# Altium project OCP-TimeCardMini-TI.PrjPcb (part 6 of 6)
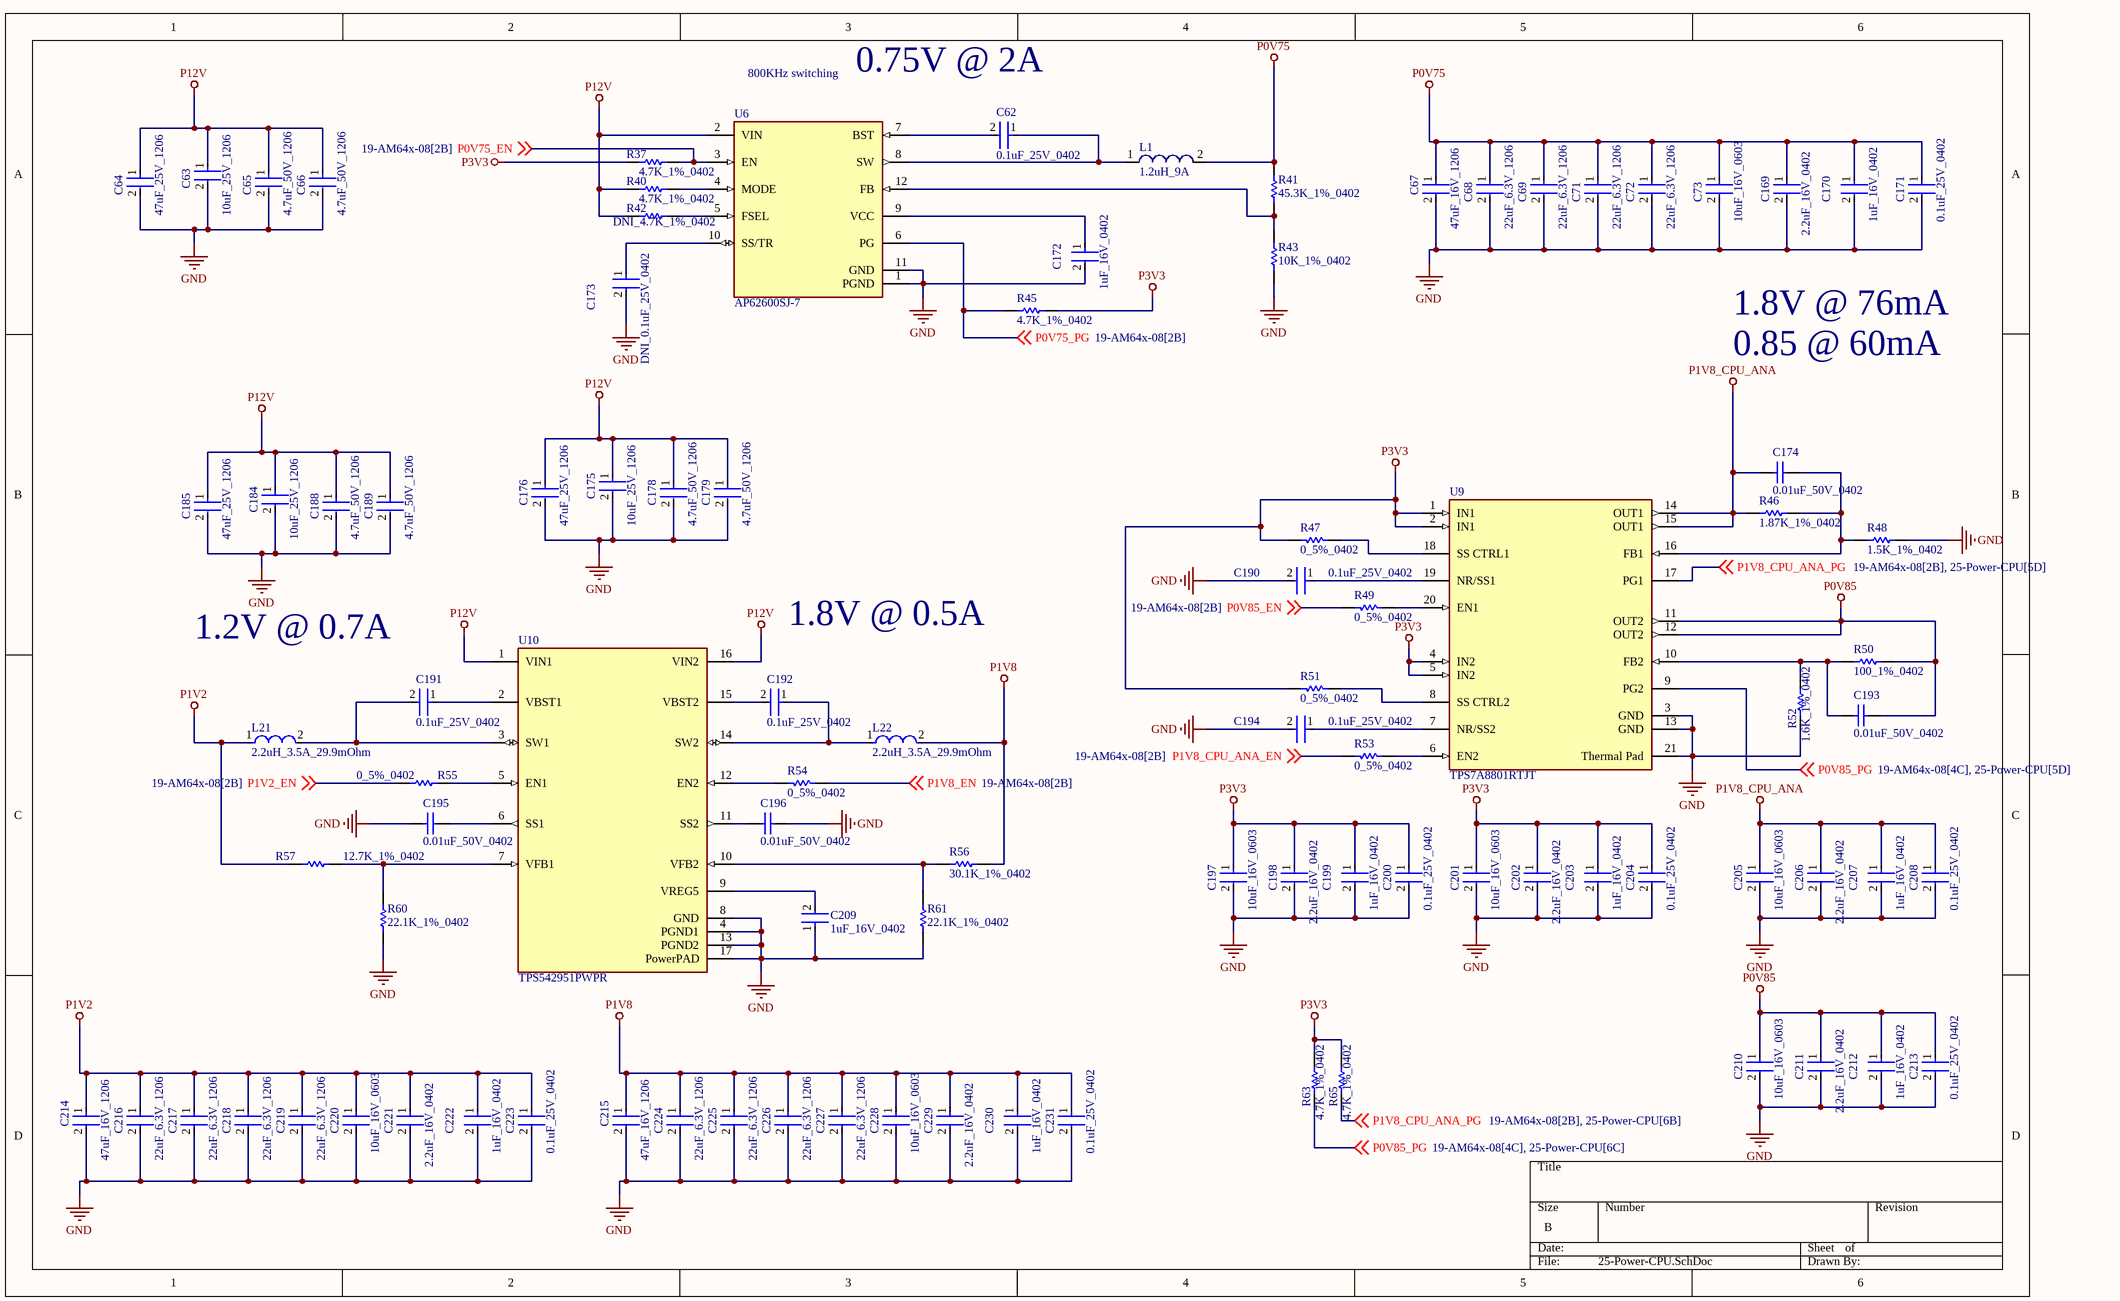
[diagram p25: 25-Power-CPU.SchDoc]

## Nets that join several sheets
DPLL_VDD_CLKA: 10-DPLL-1 (U7.71), 11-DPLL-2 (C134.1 C135.1 L15.2)
DPLL_VDD_CLKB: 10-DPLL-1 (U7.19), 11-DPLL-2 (C120.1 C121.1 L11.2)
DPLL_VDD_DCO_Q0123: 10-DPLL-1 (U7.62), 11-DPLL-2 (C102.1 C103.1 L6.2)
DPLL_VDD_DCO_Q4567: 10-DPLL-1 (U7.30), 11-DPLL-2 (C113.1 C114.1 L9.2)
DPLL_VDD_DIA_A: 10-DPLL-1 (U7.63), 11-DPLL-2 (C77.1 C78.1 L3.2)
DPLL_VDD_DIA_B: 10-DPLL-1 (U7.29), 11-DPLL-2 (C92.1 C93.1 L4.2)
DPLL_VDD_DIG: 10-DPLL-1 (U7.9), 11-DPLL-2 (5 pins)
DPLL_VDD_GPIO: 10-DPLL-1 (U7.46), 11-DPLL-2 (5 pins)
DPLL_VDDA_BG_LC: 10-DPLL-1 (U7.25 U7.26), 11-DPLL-2 (C83.1 C84.1 C85.1 L2.2)
DPLL_VDDA_FB: 10-DPLL-1 (U7.69), 11-DPLL-2 (C125.1 C126.1 L13.2)
DPLL_VDDA_PDCP_XTAL: 10-DPLL-1 (U7.68), 11-DPLL-2 (C99.1 C100.1 L5.2)
DPLL_VDDO_Q0: 10-DPLL-1 (U7.61), 11-DPLL-2 (C111.1 C112.1 L8.2)
DPLL_VDDO_Q1: 10-DPLL-1 (U7.55), 11-DPLL-2 (C127.1 C128.1 L12.2)
DPLL_VDDO_Q2: 10-DPLL-1 (U7.54), 11-DPLL-2 (C139.1 C140.1 L16.2)
DPLL_VDDO_Q3: 10-DPLL-1 (U7.50), 11-DPLL-2 (C148.1 C149.1 L18.2)
DPLL_VDDO_Q4: 10-DPLL-1 (U7.42), 11-DPLL-2 (C106.1 C107.1 L7.2)
DPLL_VDDO_Q5: 10-DPLL-1 (U7.38), 11-DPLL-2 (C118.1 C119.1 L10.2)
DPLL_VDDO_Q6: 10-DPLL-1 (U7.37), 11-DPLL-2 (C132.1 C133.1 L14.2)
DPLL_VDDO_Q7: 10-DPLL-1 (U7.31), 11-DPLL-2 (C143.1 C144.1 L17.2)
GND: 01-PCIe (21 pins), 02-USER_IO (15 pins), 04-Front Panel SFP+ (120 pins), 05-High Speed MUX (16 pins), 06-1G Phy0 (39 pins), 07-1G Phy1 (39 pins), 08-1G Phy2 (39 pins), 09-General I2C Devices (7 pins), 10-DPLL-1 (12 pins), 11-DPLL-2 (82 pins), 12-AM64x-01 (P1.2 R66.1), 13-AM64x-02 (5 pins), 15-AM64x-04 (28 pins), 16-AM64x-05 (9 pins), 17-AM64x-06 (66 pins), 18-AM64x-07 (72 pins), 19-AM64x-08 (32 pins), 20-AM64x-BootSelect (12 pins), 21-M2_GNSS (18 pins), 22-TimingConnections (23 pins), 23-POWER-P12V (14 pins), 24-Power-P3V3_P1V8DPLL (31 pins), 25-Power-CPU (76 pins)
P0V75: 16-AM64x-05 (11 pins), 18-AM64x-07 (17 pins), 25-Power-CPU (11 pins)
P0V85: 16-AM64x-05 (U12.K13 U12.L10 U12.M13), 18-AM64x-07 (7 pins), 25-Power-CPU (8 pins)
P1V2: 17-AM64x-06 (7 pins), 19-AM64x-08 (12 pins), 25-Power-CPU (11 pins)
P1V8: 19-AM64x-08 (FB9.1 J11.2), 25-Power-CPU (11 pins)
P1V8_CPU_ANA: 16-AM64x-05 (U12.G11 U12.L11), 17-AM64x-06 (U12.H13), 18-AM64x-07 (6 pins), 19-AM64x-08 (5 pins), 25-Power-CPU (8 pins)
P1V8_DPLL: 11-DPLL-2 (13 pins), 24-Power-P3V3_P1V8DPLL (6 pins)
P3V3: 01-PCIe (R22.2), 02-USER_IO (7 pins), 03-USER_IO_STATUS (D3.2 D9.2 D10.2 D11.2), 04-Front Panel SFP+ (45 pins), 05-High Speed MUX (8 pins), 06-1G Phy0 (16 pins), 07-1G Phy1 (16 pins), 08-1G Phy2 (16 pins), 09-General I2C Devices (12 pins), 10-DPLL-1 (5 pins), 11-DPLL-2 (43 pins), 12-AM64x-01 (P1.1 R67.1 R68.1), 13-AM64x-02 (R105.1 U15.3), 19-AM64x-08 (13 pins), 20-AM64x-BootSelect (R188.1 R189.1 R192.1 R196.1), 21-M2_GNSS (13 pins), 22-TimingConnections (11 pins), 23-POWER-P12V (C19.2 C20.1 U2.5), 24-Power-P3V3_P1V8DPLL (19 pins), 25-Power-CPU (18 pins)
P12V: 23-POWER-P12V (8 pins), 24-Power-P3V3_P1V8DPLL (8 pins), 25-Power-CPU (17 pins)
P12V_PCIE: 01-PCIe (5 pins), 23-POWER-P12V (CR1.1 R44.1)
ADC0_VREFP: 12-AM64x-01 (U12.J15), 19-AM64x-08 (R186.1 R187.1)
ANT1_IO_SEL: 02-USER_IO (R14.2 U1.10), 10-DPLL-1 (U7.64)
ANT2_IO_SEL: 02-USER_IO (R29.2 U4.10), 10-DPLL-1 (U7.47)
BOOTMODE0: 13-AM64x-02 (U12.T20), 20-AM64x-BootSelect (R188.2)
BOOTMODE1: 13-AM64x-02 (U12.U21), 20-AM64x-BootSelect (R189.2)
BOOTMODE2: 13-AM64x-02 (U12.T18), 20-AM64x-BootSelect (R190.2)
BOOTMODE3: 13-AM64x-02 (U12.U20), 20-AM64x-BootSelect (R191.2)
BOOTMODE4: 13-AM64x-02 (U12.U18), 20-AM64x-BootSelect (R192.2)
BOOTMODE5: 13-AM64x-02 (U12.U19), 20-AM64x-BootSelect (R193.2)
BOOTMODE6: 13-AM64x-02 (U12.V20), 20-AM64x-BootSelect (R194.2)
BOOTMODE7: 13-AM64x-02 (U12.V21), 20-AM64x-BootSelect (R195.2)
BOOTMODE8: 13-AM64x-02 (U12.V19), 20-AM64x-BootSelect (R196.2)
BOOTMODE9: 13-AM64x-02 (U12.T17), 20-AM64x-BootSelect (R197.2)
BOOTMODE10: 13-AM64x-02 (U12.R16), 20-AM64x-BootSelect (R198.2)
BOOTMODE11: 13-AM64x-02 (U12.W20), 20-AM64x-BootSelect (R199.2)
BOOTMODE12: 13-AM64x-02 (U12.W21), 20-AM64x-BootSelect (R200.2)
BOOTMODE13: 13-AM64x-02 (U12.V18), 20-AM64x-BootSelect (R201.2)
BOOTMODE14: 13-AM64x-02 (U12.Y21), 20-AM64x-BootSelect (R202.2)
BOOTMODE15: 13-AM64x-02 (U12.Y20), 20-AM64x-BootSelect (R203.2)
CP_GEMAC_CPTS0_HW1TSPUSH: 13-AM64x-02 (U12.L21), 22-TimingConnections (R253.2)
CP_GEMAC_CPTS0_HW2TSPUSH: 13-AM64x-02 (U12.K21), 22-TimingConnections (R254.2)
CPSW_RGMII1_RD0: 06-1G Phy0 (U20.33), 14-AM64x-03 (U12.AA13)
CPSW_RGMII1_RD1: 06-1G Phy0 (U20.34), 14-AM64x-03 (U12.U12)
CPSW_RGMII1_RD2: 06-1G Phy0 (U20.35), 14-AM64x-03 (U12.Y13)
CPSW_RGMII1_RD3: 06-1G Phy0 (U20.36), 14-AM64x-03 (U12.V12)
CPSW_RGMII1_RX_CTL: 06-1G Phy0 (U20.38), 14-AM64x-03 (U12.V13)
CPSW_RGMII1_RXC: 06-1G Phy0 (U20.32), 14-AM64x-03 (U12.W13)
CPSW_RGMII1_TD0: 06-1G Phy0 (U20.28), 14-AM64x-03 (U12.V15)
CPSW_RGMII1_TD1: 06-1G Phy0 (U20.27), 14-AM64x-03 (U12.V14)
CPSW_RGMII1_TD2: 06-1G Phy0 (U20.26), 14-AM64x-03 (U12.W14)
CPSW_RGMII1_TD3: 06-1G Phy0 (U20.25), 14-AM64x-03 (U12.AA14)
CPSW_RGMII1_TX_CTL: 06-1G Phy0 (U20.37), 14-AM64x-03 (U12.U15)
CPSW_RGMII1_TXC: 06-1G Phy0 (U20.29), 14-AM64x-03 (U12.U14)
CPSW_RGMII2_MDC: 06-1G Phy0 (U20.42), 14-AM64x-03 (U12.R2)
CPSW_RGMII2_MDIO: 06-1G Phy0 (R132.1 U20.41), 14-AM64x-03 (U12.P5)
CPTS0_HW1TSPUSH: 14-AM64x-03 (U12.V7), 22-TimingConnections (R257.2)
CPTS0_HW2TSPUSH: 14-AM64x-03 (U12.U13), 22-TimingConnections (R258.2)
CPTS0_RFT_CLK: 12-AM64x-01 (U12.D18), 22-TimingConnections (R213.2)
CPTS0_TS_COMP: 14-AM64x-03 (U12.W1), 22-TimingConnections (R232.1)
CPTS0_TS_SYNC: 14-AM64x-03 (U12.U1), 22-TimingConnections (R225.1)
DCTCXO_SCL: 09-General I2C Devices (R120.1 U13.11), 11-DPLL-2 (Y2.3)
DCTCXO_SDA: 09-General I2C Devices (R119.1 U13.10), 11-DPLL-2 (Y2.2)
DPLL_CLKIN_0_N: 10-DPLL-1 (U7.2), 22-TimingConnections (R208.2)
DPLL_CLKIN_0_P: 02-USER_IO (R111.2), 10-DPLL-1 (U7.1)
DPLL_CLKIN_1_N: 10-DPLL-1 (U7.4), 22-TimingConnections (R209.2)
DPLL_CLKIN_1_P: 02-USER_IO (R122.2), 10-DPLL-1 (U7.3)
DPLL_CLKIN_2_N: 05-High Speed MUX (C241.1), 10-DPLL-1 (U7.6)
DPLL_CLKIN_2_P: 05-High Speed MUX (C240.1), 10-DPLL-1 (U7.5)
DPLL_CLKIN_3_N: 05-High Speed MUX (C244.1), 10-DPLL-1 (U7.8)
DPLL_CLKIN_3_P: 05-High Speed MUX (C243.1), 10-DPLL-1 (U7.7)
DPLL_CLKIN_4_N: 10-DPLL-1 (U7.12), 22-TimingConnections (R205.2)
DPLL_CLKIN_4_P: 10-DPLL-1 (U7.11), 22-TimingConnections (R204.2)
DPLL_CLKIN_5_N: 10-DPLL-1 (U7.14), 22-TimingConnections (R224.1)
DPLL_CLKIN_5_N_SEL0: 14-AM64x-03 (U12.W5), 22-TimingConnections (R234.1 U37.1)
DPLL_CLKIN_5_N_SEL1: 14-AM64x-03 (U12.R1), 22-TimingConnections (R235.1 U37.16)
DPLL_CLKIN_5_N_SEL2: 14-AM64x-03 (U12.Y5), 22-TimingConnections (R236.1 U37.15)
DPLL_CLKIN_5_P: 10-DPLL-1 (U7.13), 22-TimingConnections (R214.2)
DPLL_CLKIN_6_N: 10-DPLL-1 (U7.16), 22-TimingConnections (R210.2)
DPLL_CLKOUT0_P: 02-USER_IO (R112.2), 10-DPLL-1 (U7.60)
DPLL_CLKOUT1_P: 02-USER_IO (R110.2), 10-DPLL-1 (U7.56)
DPLL_CLKOUT2_N: 05-High Speed MUX (C234.1), 10-DPLL-1 (U7.52)
DPLL_CLKOUT2_P: 05-High Speed MUX (C235.1), 10-DPLL-1 (U7.53)
DPLL_CLKOUT3_N: 05-High Speed MUX (C237.1), 10-DPLL-1 (U7.48)
DPLL_CLKOUT3_P: 05-High Speed MUX (C238.1), 10-DPLL-1 (U7.49)
DPLL_CLKOUT4_N: 10-DPLL-1 (U7.44), 22-TimingConnections (R207.1)
DPLL_CLKOUT4_P: 10-DPLL-1 (U7.43), 22-TimingConnections (R206.1)
DPLL_CLKOUT5_N: 10-DPLL-1 (U7.40), 22-TimingConnections (R213.1)
DPLL_CLKOUT5_P: 10-DPLL-1 (U7.39), 22-TimingConnections (R237.2)
DPLL_CLKOUT6_N: 10-DPLL-1 (U7.35), 22-TimingConnections (R240.2)
DPLL_CLKOUT6_P: 10-DPLL-1 (U7.36), 22-TimingConnections (R222.1)
DPLL_CS: 10-DPLL-1 (U7.23), 15-AM64x-04 (U12.D12)
DPLL_OSCI: 10-DPLL-1 (U7.67), 11-DPLL-2 (C152.2)
DPLL_SCLK: 10-DPLL-1 (R106.2 U7.20), 15-AM64x-04 (U12.D13)
DPLL_SDI: 10-DPLL-1 (U7.22), 15-AM64x-04 (U12.A14)
DPLL_SDIO: 10-DPLL-1 (R107.2 U7.21), 15-AM64x-04 (U12.A13)
DPLL_XO: 10-DPLL-1 (U7.72), 11-DPLL-2 (R81.1)
LED1: 03-USER_IO_STATUS (R35.1), 10-DPLL-1 (U7.58)
LED2: 03-USER_IO_STATUS (R36.1), 10-DPLL-1 (U7.51)
LED3: 03-USER_IO_STATUS (R38.1), 10-DPLL-1 (U7.45)
LED4: 03-USER_IO_STATUS (R39.1), 10-DPLL-1 (U7.28)
M2_GPS1_RX: 15-AM64x-04 (U12.A16), 21-M2_GNSS (J2.62)
M2_GPS1_TP1: 21-M2_GNSS (R98.2 R102.2), 22-TimingConnections (R214.1)
M2_GPS1_TX: 15-AM64x-04 (U12.B16), 21-M2_GNSS (J2.64)
M2_SCL: 09-General I2C Devices (U13.14), 21-M2_GNSS (J2.40 R99.1)
M2_SDA: 09-General I2C Devices (U13.13), 21-M2_GNSS (J2.42 R100.1)
MCU_OSC0_XI: 13-AM64x-02 (U12.C21), 22-TimingConnections (R211.2 R223.2 R260.2)
MCU_OSC0_XO: 13-AM64x-02 (U12.B20), 22-TimingConnections (R212.2)
MCU_PORZ: 12-AM64x-01 (U12.B21), 13-AM64x-02 (U15.4), 19-AM64x-08 (R180.2 R181.2 U34.4)
MCU_RESETZ: 12-AM64x-01 (U12.B12), 19-AM64x-08 (R180.1)
MCU_TIMER_IO0: 13-AM64x-02 (U12.D8), 22-TimingConnections (R227.1)
MCU_TIMER_IO1: 13-AM64x-02 (U12.E8), 22-TimingConnections (R240.1)
OSPI0_D1: 13-AM64x-02 (P3.6 R97.1), 14-AM64x-03 (U12.M18)
OSPI0_D2: 13-AM64x-02 (R96.1), 14-AM64x-03 (U12.M20)
OSPI0_D3: 13-AM64x-02 (R85.1), 14-AM64x-03 (U12.M21)
P0V75_EN: 19-AM64x-08 (R178.2), 25-Power-CPU (R37.2 U6.3)
P0V75_PG: 19-AM64x-08 (R179.1), 25-Power-CPU (R45.2 U6.6)
P0V85_EN: 19-AM64x-08 (R179.2), 25-Power-CPU (R49.2)
P0V85_PG: 19-AM64x-08 (U33.2), 25-Power-CPU (R63.2 U9.9)
P1V2_EN: 19-AM64x-08 (R177.2), 25-Power-CPU (R55.1)
P1V8_CPU_ANA_EN: 19-AM64x-08 (R176.2), 25-Power-CPU (R53.2)
P1V8_CPU_ANA_PG: 19-AM64x-08 (R177.1), 25-Power-CPU (R65.2 U9.17)
P1V8_EN: 19-AM64x-08 (R175.2), 25-Power-CPU (R54.1)
P3V3_PG: 19-AM64x-08 (R175.1 R176.1), 24-Power-P3V3_P1V8DPLL (R94.2 U8.6)
PCIE_GF_MCU_0_N: 01-PCIe (P2.B15), 15-AM64x-04 (U12.Y15)
PCIE_GF_MCU_0_P: 01-PCIe (P2.B14), 15-AM64x-04 (U12.Y16)
PCIE_MCU_GF_0_N: 01-PCIe (C47.2), 15-AM64x-04 (U12.AA16)
PCIE_MCU_GF_0_P: 01-PCIe (C46.2), 15-AM64x-04 (U12.AA17)
PCIE_PERST: 01-PCIe (P2.A11 R22.1), 06-1G Phy0 (U20.43), 07-1G Phy1 (U28.43), 08-1G Phy2 (U24.43), 09-General I2C Devices (R121.1), 10-DPLL-1 (R59.1), 19-AM64x-08 (U33.1), 21-M2_GNSS (J2.50 J2.67)
PCIE_REFCLK_N: 01-PCIe (C45.2), 22-TimingConnections (R205.1 R259.1)
PCIE_REFCLK_P: 01-PCIe (C44.2), 22-TimingConnections (R73.1 R204.1)
PHY0_GPIO0: 06-1G Phy0 (R242.2), 22-TimingConnections (R254.1)
PHY0_GPIO1: 06-1G Phy0 (R241.2), 22-TimingConnections (R253.1)
PHY1_GPIO0: 07-1G Phy1 (R252.2), 22-TimingConnections (R256.1)
PHY1_GPIO1: 07-1G Phy1 (R251.2), 22-TimingConnections (R255.1)
PHY2_GPIO0: 08-1G Phy2 (R244.2), 22-TimingConnections (R258.1)
PHY2_GPIO1: 08-1G Phy2 (R243.2), 22-TimingConnections (R257.1)
PHY_SFP0_1G_N: 04-Front Panel SFP+ (J6.19), 06-1G Phy0 (U20.14)
PHY_SFP0_1G_P: 04-Front Panel SFP+ (J6.18), 06-1G Phy0 (U20.15)
PHY_SFP1_1G_N: 05-High Speed MUX (U16.9), 07-1G Phy1 (U28.14)
PHY_SFP1_1G_P: 05-High Speed MUX (U16.8), 07-1G Phy1 (U28.15)
PHY_SFP2_1G_N: 05-High Speed MUX (U17.9), 08-1G Phy2 (U24.14)
PHY_SFP2_1G_P: 05-High Speed MUX (U17.8), 08-1G Phy2 (U24.15)
PRG0_IEP0_EDC_LATCH_IN0: 14-AM64x-03 (U12.V1), 22-TimingConnections (R255.2)
PRG0_IEP0_EDC_LATCH_IN1: 14-AM64x-03 (U12.T1), 22-TimingConnections (R256.2)
PRG0_MDIO0_MDC: 07-1G Phy1 (U28.42), 14-AM64x-03 (U12.P3)
PRG0_MDIO0_MDIO: 07-1G Phy1 (R158.1 U28.41), 14-AM64x-03 (U12.P2)
PRG0_RGMII1_RD0: 07-1G Phy1 (U28.33), 14-AM64x-03 (U12.Y1)
PRG0_RGMII1_RD1: 07-1G Phy1 (U28.34), 14-AM64x-03 (U12.R4)
PRG0_RGMII1_RD2: 07-1G Phy1 (U28.35), 14-AM64x-03 (U12.U2)
PRG0_RGMII1_RD3: 07-1G Phy1 (U28.36), 14-AM64x-03 (U12.V2)
PRG0_RGMII1_RX_CTL: 07-1G Phy1 (U28.38), 14-AM64x-03 (U12.AA2)
PRG0_RGMII1_RXC: 07-1G Phy1 (U28.32), 14-AM64x-03 (U12.T3)
PRG0_RGMII1_TD0: 07-1G Phy1 (U28.28), 14-AM64x-03 (U12.Y3)
PRG0_RGMII1_TD1: 07-1G Phy1 (U28.27), 14-AM64x-03 (U12.AA3)
PRG0_RGMII1_TD2: 07-1G Phy1 (U28.26), 14-AM64x-03 (U12.R6)
PRG0_RGMII1_TD3: 07-1G Phy1 (U28.25), 14-AM64x-03 (U12.V4)
PRG0_RGMII1_TX_CTL: 07-1G Phy1 (U28.37), 14-AM64x-03 (U12.T5)
PRG0_RGMII1_TXC: 07-1G Phy1 (U28.29), 14-AM64x-03 (U12.U4)
PRG1_IEP0_EDC_SYNC_OUT0: 14-AM64x-03 (U12.W7), 22-TimingConnections (R231.1)
PRG1_IEP0_EDC_SYNC_OUT1: 14-AM64x-03 (U12.U7), 22-TimingConnections (R226.1)
PRG1_MDIO0_MDC: 08-1G Phy2 (U24.42), 14-AM64x-03 (U12.Y6)
PRG1_MDIO0_MDIO: 08-1G Phy2 (R146.1 U24.41), 14-AM64x-03 (U12.AA6)
PRG1_RGMII1_RD0: 08-1G Phy2 (U24.33), 14-AM64x-03 (U12.Y7)
PRG1_RGMII1_RD1: 08-1G Phy2 (U24.34), 14-AM64x-03 (U12.U8)
PRG1_RGMII1_RD2: 08-1G Phy2 (U24.35), 14-AM64x-03 (U12.W8)
PRG1_RGMII1_RD3: 08-1G Phy2 (U24.36), 14-AM64x-03 (U12.V8)
PRG1_RGMII1_RX_CTL: 08-1G Phy2 (U24.38), 14-AM64x-03 (U12.Y8)
PRG1_RGMII1_RXC: 08-1G Phy2 (U24.32), 14-AM64x-03 (U12.AA7)
PRG1_RGMII1_TD0: 08-1G Phy2 (U24.28), 14-AM64x-03 (U12.AA8)
PRG1_RGMII1_TD1: 08-1G Phy2 (U24.27), 14-AM64x-03 (U12.U9)
PRG1_RGMII1_TD2: 08-1G Phy2 (U24.26), 14-AM64x-03 (U12.W9)
PRG1_RGMII1_TD3: 08-1G Phy2 (U24.25), 14-AM64x-03 (U12.AA9)
PRG1_RGMII1_TX_CTL: 08-1G Phy2 (U24.37), 14-AM64x-03 (U12.Y9)
PRG1_RGMII1_TXC: 08-1G Phy2 (U24.29), 14-AM64x-03 (U12.V9)
SCL: 09-General I2C Devices (R124.1 U13.22), 13-AM64x-02 (U12.A18)
SDA: 09-General I2C Devices (R123.1 U13.23), 13-AM64x-02 (U12.B18)
SERDES0_REFCLK0_N: 15-AM64x-04 (U12.W16), 22-TimingConnections (R207.2 R259.2)
SERDES0_REFCLK0_P: 15-AM64x-04 (U12.W17), 22-TimingConnections (R73.2 R206.2)
SFP0_PHY_1G_N: 04-Front Panel SFP+ (J6.12), 06-1G Phy0 (U20.17)
SFP0_PHY_1G_P: 04-Front Panel SFP+ (J6.13), 06-1G Phy0 (U20.16)
SFP0_PHY_25M: 06-1G Phy0 (U20.20), 22-TimingConnections (R215.2 R218.2)
SFP0_PHY_SYNCE_CLK: 06-1G Phy0 (U20.40), 22-TimingConnections (R208.1)
SFP0_PHY_XO: 06-1G Phy0 (U20.19), 22-TimingConnections (R219.2)
SFP1_PHY_1G_N: 05-High Speed MUX (U18.8), 07-1G Phy1 (U28.17)
SFP1_PHY_1G_P: 05-High Speed MUX (U18.9), 07-1G Phy1 (U28.16)
SFP1_PHY_25M: 07-1G Phy1 (U28.20), 22-TimingConnections (R217.2 R228.2)
SFP1_PHY_SYNCE_CLK: 07-1G Phy1 (U28.40), 22-TimingConnections (R209.1)
SFP1_PHY_XO: 07-1G Phy1 (U28.19), 22-TimingConnections (R229.2)
SFP1_RX_N: 04-Front Panel SFP+ (J8.12), 05-High Speed MUX (U18.3)
SFP1_RX_P: 04-Front Panel SFP+ (J8.13), 05-High Speed MUX (U18.2)
SFP1_SCL: 04-Front Panel SFP+ (J6.5 R4.2), 09-General I2C Devices (U13.5)
SFP1_SDA: 04-Front Panel SFP+ (J6.4 R3.2), 09-General I2C Devices (U13.4)
SFP1_SEL: 05-High Speed MUX (R113.2 R125.2 U16.4 U18.4), 14-AM64x-03 (U12.Y2)
SFP1_TX_N: 04-Front Panel SFP+ (J8.19), 05-High Speed MUX (U16.2)
SFP1_TX_P: 04-Front Panel SFP+ (J8.18), 05-High Speed MUX (U16.3)
SFP2_PHY_1G_N: 05-High Speed MUX (U19.8), 08-1G Phy2 (U24.17)
SFP2_PHY_1G_P: 05-High Speed MUX (U19.9), 08-1G Phy2 (U24.16)
SFP2_PHY_25M: 08-1G Phy2 (U24.20), 22-TimingConnections (R221.2 R238.2)
SFP2_PHY_SYNCE_CLK: 08-1G Phy2 (U24.40), 22-TimingConnections (R210.1)
SFP2_PHY_XO: 08-1G Phy2 (U24.19), 22-TimingConnections (R239.2)
SFP2_RX_N: 04-Front Panel SFP+ (J9.12), 05-High Speed MUX (U19.3)
SFP2_RX_P: 04-Front Panel SFP+ (J9.13), 05-High Speed MUX (U19.2)
SFP2_SCL: 04-Front Panel SFP+ (J8.5 R12.2), 09-General I2C Devices (U13.7)
SFP2_SDA: 04-Front Panel SFP+ (J8.4 R11.2), 09-General I2C Devices (U13.6)
SFP2_SEL: 05-High Speed MUX (R115.2 R130.2 U17.4 U19.4), 14-AM64x-03 (U12.W6)
SFP2_TX_N: 04-Front Panel SFP+ (J9.19), 05-High Speed MUX (U17.2)
SFP2_TX_P: 04-Front Panel SFP+ (J9.18), 05-High Speed MUX (U17.3)
SFP3_SCL: 04-Front Panel SFP+ (J9.5 R21.2), 09-General I2C Devices (U13.16)
SFP3_SDA: 04-Front Panel SFP+ (J9.4 R19.2), 09-General I2C Devices (U13.15)
SOC_DVDD1V8: 15-AM64x-04 (U12.E12 U12.K16), 17-AM64x-06 (U12.K14), 19-AM64x-08 (8 pins)
SOC_DVDD3V3: 15-AM64x-04 (U12.F13 U12.F14), 16-AM64x-05 (C338.2 U12.H15 U12.K15 U12.R13), 17-AM64x-06 (18 pins), 18-AM64x-07 (20 pins), 19-AM64x-08 (FB8.2)
TIMER_IO0: 13-AM64x-02 (U12.C18), 22-TimingConnections (R237.1)
TIMER_IO1: 13-AM64x-02 (U12.B19), 22-TimingConnections (R230.1)
TOP_SENS_I2C_SCL: 09-General I2C Devices (R118.1 U3.1 U13.9), 23-POWER-P12V (U2.4)
TOP_SENS_I2C_SDA: 09-General I2C Devices (R117.1 U3.3 U13.8), 23-POWER-P12V (U2.3)
VDD_DLL_MMC0: 16-AM64x-05 (U12.H14), 18-AM64x-07 (C353.1 C354.1 C355.1 L26.2)
VDDA_1V8_MCU: 16-AM64x-05 (U12.K12), 18-AM64x-07 (C356.1 C357.1 C358.1 L27.2)
VDDA_1V8_SERDES: 16-AM64x-05 (U12.R14), 18-AM64x-07 (C340.1 C341.1 C342.1 L23.2)
VDDA_1V8_USB0: 16-AM64x-05 (U12.R15), 18-AM64x-07 (C350.1 C351.1 C352.1 L25.2)
VDDA_PLL0: 16-AM64x-05 (U12.N12), 18-AM64x-07 (C362.1 C363.1 C364.1 L29.2)
VDDA_PLL1: 16-AM64x-05 (U12.H9), 18-AM64x-07 (C379.1 C380.1 C381.1 L30.2)
VDDA_PLL2: 16-AM64x-05 (U12.J11), 18-AM64x-07 (C395.1 C396.1 C397.1 L31.2)
VDDA_SYS_MON: 15-AM64x-04 (U12.K10), 18-AM64x-07 (R173.2 R174.1)
VDDAR_0P85_SERDES0: 16-AM64x-05 (U12.P11 U12.P12 U12.P13), 18-AM64x-07 (8 pins)
VDDAR_0P85_USB0: 16-AM64x-05 (U12.T12), 18-AM64x-07 (C359.1 C360.1 C361.1 L28.2)
VPP_1V8: 17-AM64x-06 (U12.G15), 19-AM64x-08 (J11.1 R185.1)